# Altium schematic sheet AUDIO.SchDoc
size A3; Revision: 1.0; SheetNumber: 5; SheetTotal: 7
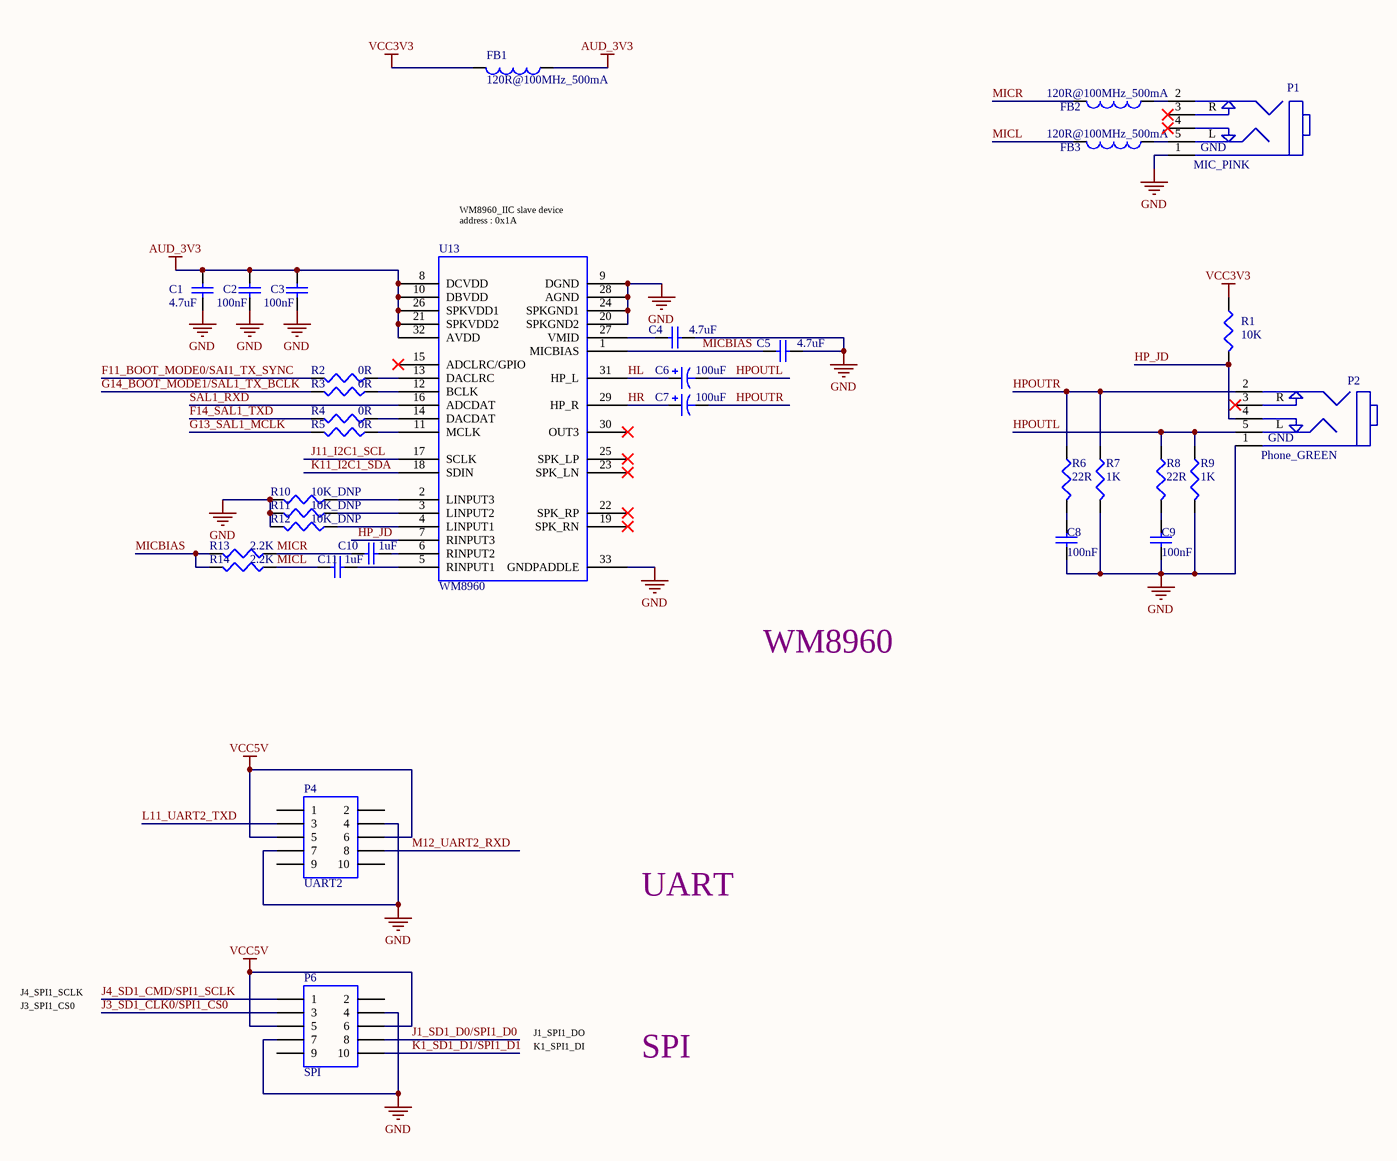
[diagram p0: AUDIO.SchDoc]

## Parts
C1  4.7uF  [0603C+]
C2  100nF  [0603C+]
C3  100nF  [0603C+]
C4  4.7uF  [0603C+]
C5  4.7uF  [0603C+]
C6  100uF  [TC3528B]
C7  100uF  [TC3528B]
C8  100nF  [0603C+]
C9  100nF  [0603C+]
C10  1uF  [0603C+]
C11  1uF  [0603C+]
FB1  120R@100MHz_500mA  [0603R+]
FB2  120R@100MHz_500mA  [0603R+]
FB3  120R@100MHz_500mA  [0603R+]
P1  MIC_PINK  [PHONEJACK SW]
P2  Phone_GREEN  [PHONEJACK SW]
P4  UART2  [IDC10S]
P6  SPI  [IDC10S]
R1  10K  [0603R+]
R2  0R  [0603R+]
R3  0R  [0603R+]
R4  0R  [0603R+]
R5  0R  [0603R+]
R6  22R  [0603R+]
R7  1K  [0603R+]
R8  22R  [0603R+]
R9  1K  [0603R+]
R10  10K_DNP  [0603R+]
R11  10K_DNP  [0603R+]
R12  10K_DNP  [0603R+]
R13  2.2K  [0603R+]
R14  2.2K  [0603R+]
U13  WM8960  [WM8960]

## Nets
AUD_3V3: C1.2 C2.2 C3.2 FB1.1 U13.8(DCVDD) U13.10(DBVDD) U13.21(SPKVDD2) U13.26(SPKVDD1) U13.32(AVDD)
GND: C1.1 C2.1 C3.1 C4.1 C5.1 C8.2 C9.2 P1.1(GND) P2.1(GND) P4.4 P4.7 P6.4 P6.7 R7.2 R9.2 R10.2 R11.2 R12.2 U13.9(DGND) U13.20(SPKGND2) U13.24(SPKGND1) U13.28(AGND) U13.33(GNDPADDLE)
VCC3V3: FB1.2 R1.1
VCC5V: P4.5 P4.6 P6.5 P6.6
F11_BOOT_MODE0/SAI1_TX_SYNC: R2.2
F14_SAL1_TXD: R4.2
G13_SAL1_MCLK: R5.2
G14_BOOT_MODE1/SAL1_TX_BCLK: R3.2
HL: C6.1 U13.31(HP_L)
HP_JD: P2.4 R1.2 U13.7(RINPUT3)
HPOUTL: C6.2 P2.5 R8.1 R9.1
HPOUTR: C7.2 P2.2 R6.1 R7.1
HR: C7.1 U13.29(HP_R)
J1_SD1_D0/SPI1_D0: P6.8
J3_SD1_CLK0/SPI1_CS0: P6.3
J4_SD1_CMD/SPI1_SCLK: P6.1
J11_I2C1_SCL: U13.17(SCLK)
K1_SD1_D1/SPI1_D1: P6.10
K11_I2C1_SDA: U13.18(SDIN)
L11_UART2_TXD: P4.3
M12_UART2_RXD: P4.8
MICBIAS: C5.2 R13.2 R14.2 U13.1(MICBIAS)
MICL: C11.2 FB3.2 R14.1
MICR: C10.2 FB2.2 R13.1
SAL1_RXD: U13.16(ADCDAT)
NetC4_2: C4.2 U13.27(VMID)
NetC8_1: C8.1 R6.2
NetC9_1: C9.1 R8.2
NetC10_1: C10.1 U13.6(RINPUT2)
NetC11_1: C11.1 U13.5(RINPUT1)
NetFB2_1: FB2.1 P1.2
NetFB3_1: FB3.1 P1.5
NetR2_1: R2.1 U13.13(DACLRC)
NetR3_1: R3.1 U13.12(BCLK)
NetR4_1: R4.1 U13.14(DACDAT)
NetR5_1: R5.1 U13.11(MCLK)
NetR10_1: R10.1 U13.2(LINPUT3)
NetR11_1: R11.1 U13.3(LINPUT2)
NetR12_1: R12.1 U13.4(LINPUT1)

Not connected (* = marked no-connect by the designer): P1 3* 4*; P2 3*; P4 1 2 9 10; P6 2 9; U13 15(ADCLRC/GPIO)* 19(SPK_RN)* 22(SPK_RP)* 23(SPK_LN)* 25(SPK_LP)* 30(OUT3)*

## Notes on the sheet
- WM8960_IIC slave device address : 0x1A
- WM8960
- UART
- SPI
- Labels drawn without touching a wire or pin: J1_SPI1_DO, J3_SPI1_CS0, J4_SPI1_SCLK, K1_SPI1_DI
- 设计
- 审核
- 工艺
- 图纸名称
- 郝成东
- 批准
- 标准化
- 日期
- 版本
- 页码
- 第
- 页
- 共
- (in symbol Phonejack Stereo SW) R; L

## Library data of the parts
C1-C5 C8-C11 = Cap: Capacitor; Published: 8-Jun-2000; LatestRevisionDate: 17-Jul-2002; LatestRevisionNote: Re-released for DXP Platform.; PackageReference: RAD-0.3; Publisher: Altium Limited; PackageDescription: Radial Cap, Thru-Hole; 2 Leads; 0.3 in Pin Spacing
  C1 C4 C5: Value: 4.7uF
  C2 C3 C8 C9: Value: 100nF
  C10 C11: Value: 1uF
C6 C7 = Cap Pol1: Polarized Capacitor (Radial); Published: 8-Jun-2000; LatestRevisionDate: 17-Jul-2002; LatestRevisionNote: Re-released for DXP Platform.; PackageReference: RB7.6-15; Publisher: Altium Limited; PackageDescription: Polarized Capacitor (Radial); 2 Leads; Value: 100uF
FB1-FB3 = Inductor: Code_IEC: 1005; Published: 8-Jun-2000; LatestRevisionDate: 29-May-2009; LatestRevisionNote: IPC-7351 Footprint Added.; PackageReference: 0402-A; Publisher: Altium Limited; PackageDescription: Chip Inductor; Code_JEITA: 0402; Value: 120R@100MHz_500mA
P1 P2 = Phonejack Stereo SW: VALUE: HEDAJACK
P4 P6 = Header 5X2: Header, 5-Pin, Dual row; LatestRevisionDate: 17-Jul-2002; LatestRevisionNote: Re-released for DXP Platform.; Publisher: Altium Limited
R1-R14 = Res3: Resistor; Published: 8-Jun-2000; LatestRevisionDate: 29-May-2009; LatestRevisionNote: IPC-7351 Footprint Added.; PackageReference: J1-0603; Publisher: Altium Limited; PackageDescription: Chip Resistor
  R1: Value: 10K
  R2-R5: Value: 0R
  R6 R8: Value: 22R
  R7 R9: Value: 1K
  R10-R12: Value: 10K_DNP
  R13 R14: Value: 2.2K